# EAGLE schematic basic_schematic_pullup (EAGLE 9.6.2)
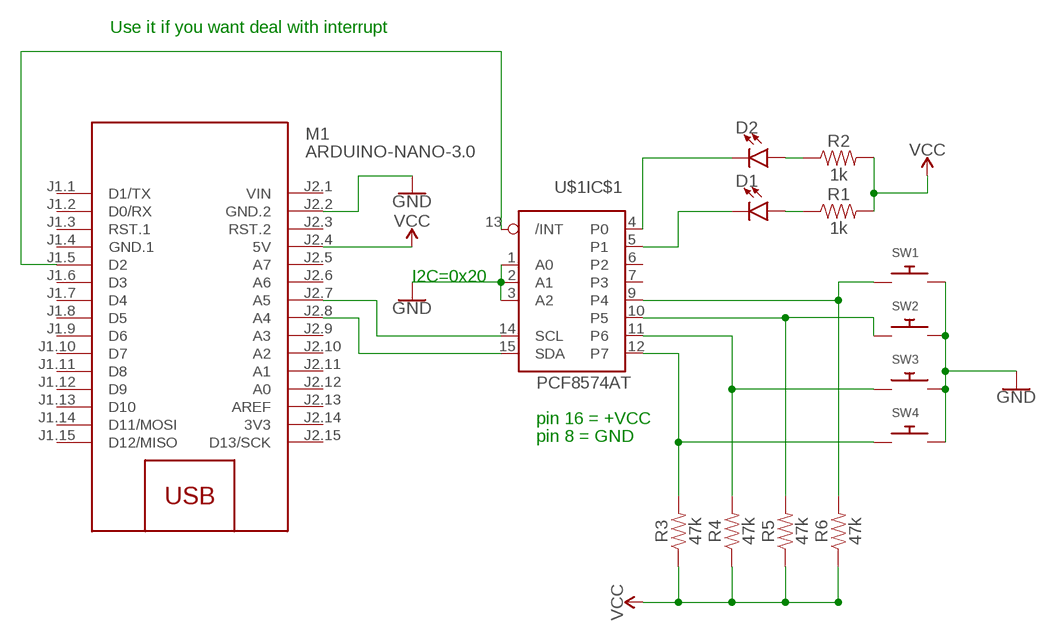
[diagram p0: schematic, sheet 1]

## Parts
D1  LED3MM  [LED_3MM]
D2  LED3MM  [LED_3MM]
M1  ARDUINO-NANO-3.0  [ARDUINO-NANO-3.0]
R1  1k  1KOHM-0603-1/10W-1%  [0603]
R2  1k  1KOHM-0603-1/10W-1%  [0603]
R3  47k  47KOHM-0603-1/10W-1%  [0603]
R4  47k  47KOHM-0603-1/10W-1%  [0603]
R5  47k  47KOHM-0603-1/10W-1%  [0603]
R6  47k  47KOHM-0603-1/10W-1%  [0603]
SW1  SWITCH_PUSHBUTTONC&K_KSS  [BTN_CK_KSS]
SW2  SWITCH_PUSHBUTTONC&K_KSS  [BTN_CK_KSS]
SW3  SWITCH_PUSHBUTTONC&K_KSS  [BTN_CK_KSS]
SW4  SWITCH_PUSHBUTTONC&K_KSS  [BTN_CK_KSS]
U$1  PCF8574AT  [SO16]

## Nets
GND: M1.J2.2(GND.2) SW1.P$2 SW2.P$2 SW3.P$2 SW4.P$2 U$1.1(IC$1:A0) U$1.2(IC$1:A1) U$1.3(IC$1:A2)
N$1: D2.K(C) U$1.4(IC$1:P0)
N$2: D1.K(C) U$1.5(IC$1:P1)
N$3: D2.A R2.1
N$4: R3.2 SW4.P$1 U$1.12(IC$1:P7)
N$5: D1.A R1.1
N$6: R4.2 SW3.P$1 U$1.11(IC$1:P6)
N$7: R5.2 SW2.P$1 U$1.10(IC$1:P5)
N$8: R6.2 SW1.P$1 U$1.9(IC$1:P4)
N$9: M1.J2.7(A5) U$1.14(IC$1:SCL)
N$10: M1.J2.8(A4) U$1.15(IC$1:SDA)
N$11: M1.J1.5(D2) U$1.13(IC$1:/INT)
VCC: M1.J2.4(5V) R1.2 R2.2 R3.1 R4.1 R5.1 R6.1
Unconnected: M1.J1.1(D1/TX) M1.J1.2(D0/RX) M1.J1.3(RST.1) M1.J1.6(D3) M1.J1.7(D4) M1.J1.8(D5) M1.J1.9(D6) M1.J1.10(D7) M1.J1.11(D8) M1.J1.12(D9) M1.J1.13(D10) M1.J1.14(D11/MOSI) M1.J1.15(D12/MISO) M1.J2.3(RST.2) M1.J2.5(A7) M1.J2.6(A6) M1.J2.9(A3) M1.J2.10(A2) M1.J2.11(A1) M1.J2.12(A0) M1.J2.13(AREF) M1.J2.15(D13/SCK) U$1.6(IC$1:P2) U$1.7(IC$1:P3)

## Notes on the sheet
- Use it if you want deal with interrupt
- I2C=0x20
- pin 16 = +VCC
- pin 8 = GND

## Power pins joined to a net without a drawn wire
3V3: M1.J2.14(3V3)
GND: U$1.8(PWR:GND)
GND.1: M1.J1.4(GND.1)
VCC: U$1.16(PWR:VCC)
VIN: M1.J2.1(VIN)

## Library data of the parts
D1 D2 = SparkFun-LED:LED: LED (Generic) Standard schematic elements and footprints for 5mm, 3mm, 1206, and 0603 sized LEDs. Generic LEDs with no color specified.; PROD_ID: DIO-08794
M1 = diy-modules:ARDUINO-NANO-3.0: Arduino Nano 3.0 and compatible devices More details available here: https://www.arduino.cc/en/Main/ArduinoBoardNano Click here to find device on ebay.com <http://www.ebay.com/sch/arduino+nano>
R1 R2 = SparkFun-Resistors:1KOHM: 1kΩ resistor A resistor is a passive two-terminal electrical component that implements electrical resistance as a circuit element. Resistors act to reduce current flow, and, at the same time, act to lower voltage levels within circuits. - Wikipedia; PROD_ID: RES-07856
R3-R6 = SparkFun-Resistors:47KOHM: 47kΩ resistor A resistor is a passive two-terminal electrical component that implements electrical resistance as a circuit element. Resistors act to reduce current flow, and, at the same time, act to lower voltage levels within circuits. - Wikipedia; PROD_ID: RES-07871
SW1-SW4 = adafruit:SWITCH_PUSHBUTTON: Buttons SOFTTOUCHSMD_SJ - Soft touch temporary push button (Super Junk Akihabara) Compatible with SKPMANE010 [Mouser: 688-SKPMAN] C&K_KSS = Digikey: KSS221GLFS
U$1 = i2c:PCF8574: Remote 8-Bit I/O Expander for I²C Bus